# Altium schematic sheet Tiny817_Xplained_Pro_Connectors.SchDoc: Extension connectors
size A3; Organization: ATMEL Norway; Address1: Vestre Rosten 79; Address2: N-7075 TILLER; Address3: NORWAY; DocumentNumber: A09-2654; Revision: 4; SheetNumber: 3; SheetTotal: 9; PageSetup: Record=PageOptions|CenterHorizontal=True|CenterVertical=True|PrintScale=1.01|XCorrection=1.00|YCorrection=1.00|PrintKind=1|BorderSize=5000000|LeftOffset=0|BottomOffset=0|Orientation=2|PaperLength=1000|PaperWidth=1000|Scale=100|PaperSource=7|PrintQuality=-4|MediaType=1|DitherType=10|PaperKind=A3 (297 x 420 mm)|PrintScaleMode=1
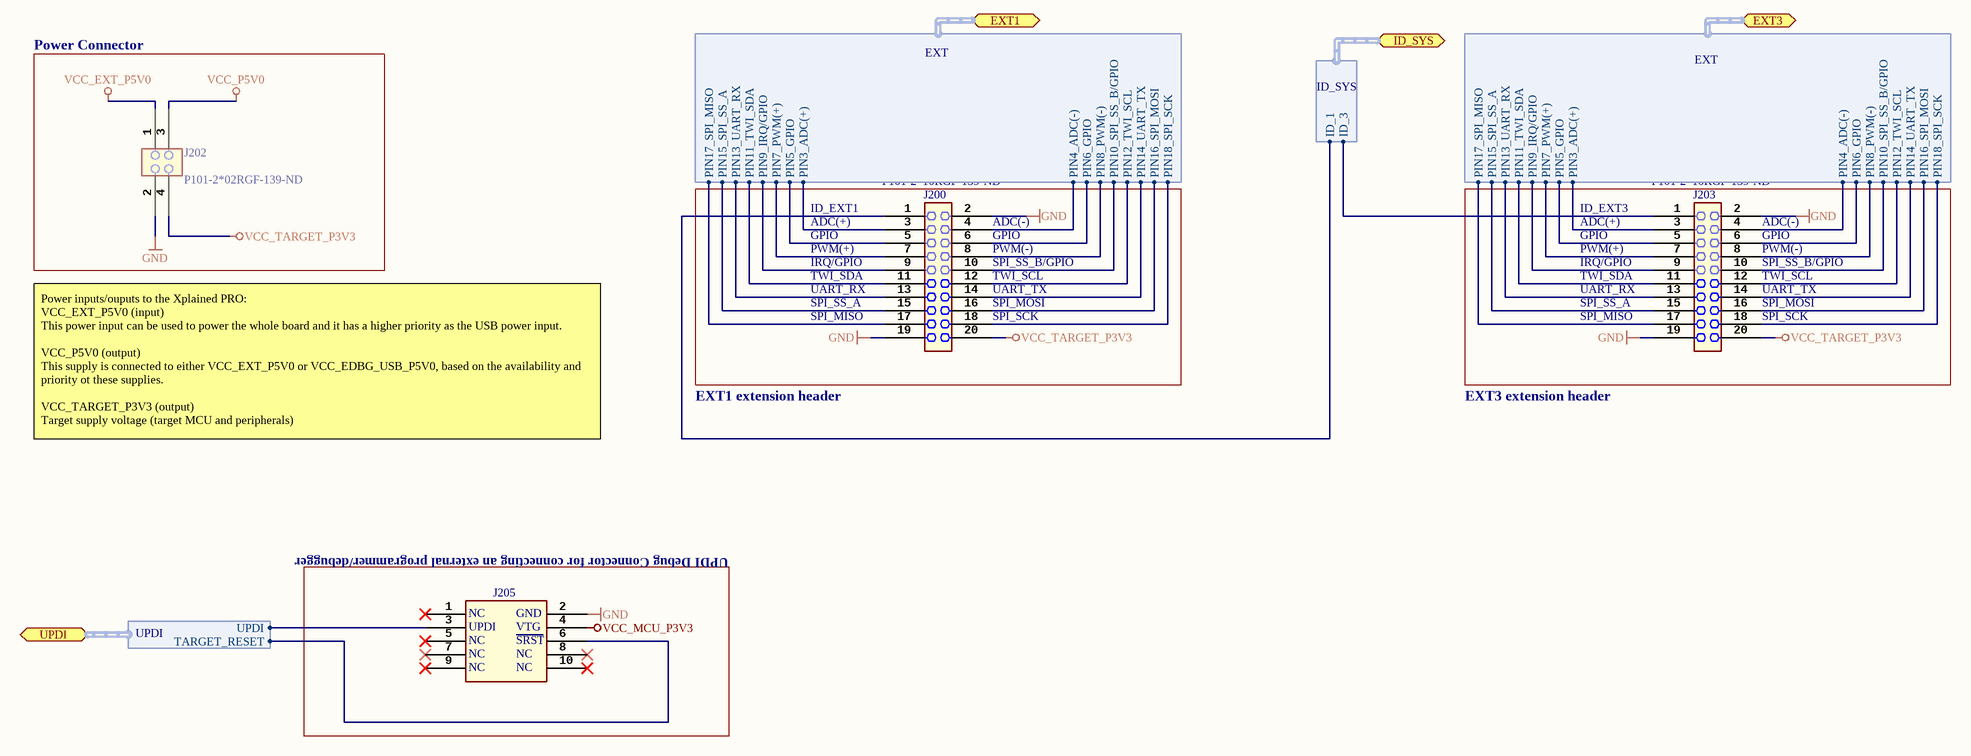
[diagram p0: Tiny817_Xplained_Pro_Connectors.SchDoc]

## Parts
J200  value P101-2*10RGF-139-ND  [AP8-00622]
J202  value P101-2*02RGF-139-ND  [AP8-00628]
J203  value P101-2*10RGF-139-ND  [AP8-00622]
J205  (no value)  [AP8-00257]

## Blocks framed on the sheet
Power Connector: J202

## Ports
EXT1 (harness EXT), EXT3 (harness EXT), ID_SYS (harness ID_SYS), UPDI (harness UPDI)

## Harnesses
ID_SYS: ID_1, ID_3
EXT: PIN3_ADC(+), PIN4_ADC(-), PIN5_GPIO, PIN6_GPIO, PIN7_PWM(+), PIN8_PWM(-), PIN9_IRQ/GPIO, PIN10_SPI_SS_B/GPIO, PIN11_TWI_SDA, PIN12_TWI_SCL, PIN13_UART_RX, PIN14_UART_TX, PIN15_SPI_SS_A, PIN16_SPI_MOSI, PIN17_SPI_MISO, PIN18_SPI_SCK
UPDI: TARGET_RESET, UPDI

## Nets
GND: J200.2 J200.19 J202.2 J203.2 J203.19 J205.2
VCC_EXT_P5V0: J202.1
VCC_MCU_P3V3: J205.4
VCC_P5V0: J202.3
VCC_TARGET_P3V3: J200.20 J202.4 J203.20
NetJ200_1: J200.1 ; port ID_SYS.ID_1
NetJ200_3: J200.3 ; port EXT1.PIN3_ADC(+)
NetJ200_4: J200.4 ; port EXT1.PIN4_ADC(-)
NetJ200_5: J200.5 ; port EXT1.PIN5_GPIO
NetJ200_6: J200.6 ; port EXT1.PIN6_GPIO
NetJ200_7: J200.7 ; port EXT1.PIN7_PWM(+)
NetJ200_8: J200.8 ; port EXT1.PIN8_PWM(-)
NetJ200_9: J200.9 ; port EXT1.PIN9_IRQ/GPIO
NetJ200_10: J200.10 ; port EXT1.PIN10_SPI_SS_B/GPIO
NetJ200_11: J200.11 ; port EXT1.PIN11_TWI_SDA
NetJ200_12: J200.12 ; port EXT1.PIN12_TWI_SCL
NetJ200_13: J200.13 ; port EXT1.PIN13_UART_RX
NetJ200_14: J200.14 ; port EXT1.PIN14_UART_TX
NetJ200_15: J200.15 ; port EXT1.PIN15_SPI_SS_A
NetJ200_16: J200.16 ; port EXT1.PIN16_SPI_MOSI
NetJ200_17: J200.17 ; port EXT1.PIN17_SPI_MISO
NetJ200_18: J200.18 ; port EXT1.PIN18_SPI_SCK
NetJ203_1: J203.1 ; port ID_SYS.ID_3
NetJ203_3: J203.3 ; port EXT3.PIN3_ADC(+)
NetJ203_4: J203.4 ; port EXT3.PIN4_ADC(-)
NetJ203_5: J203.5 ; port EXT3.PIN5_GPIO
NetJ203_6: J203.6 ; port EXT3.PIN6_GPIO
NetJ203_7: J203.7 ; port EXT3.PIN7_PWM(+)
NetJ203_8: J203.8 ; port EXT3.PIN8_PWM(-)
NetJ203_9: J203.9 ; port EXT3.PIN9_IRQ/GPIO
NetJ203_10: J203.10 ; port EXT3.PIN10_SPI_SS_B/GPIO
NetJ203_11: J203.11 ; port EXT3.PIN11_TWI_SDA
NetJ203_12: J203.12 ; port EXT3.PIN12_TWI_SCL
NetJ203_13: J203.13 ; port EXT3.PIN13_UART_RX
NetJ203_14: J203.14 ; port EXT3.PIN14_UART_TX
NetJ203_15: J203.15 ; port EXT3.PIN15_SPI_SS_A
NetJ203_16: J203.16 ; port EXT3.PIN16_SPI_MOSI
NetJ203_17: J203.17 ; port EXT3.PIN17_SPI_MISO
NetJ203_18: J203.18 ; port EXT3.PIN18_SPI_SCK
NetJ205_3: J205.3 ; port UPDI.UPDI
NetJ205_6: J205.6 ; port UPDI.TARGET_RESET

Not connected (* = marked no-connect by the designer): J205 1* 5* 7* 8* 9* 10*

## Notes on the sheet
- ID_EXT1
- ID_EXT3
- ADC(+)
- GPIO
- PWM(+)
- IRQ/GPIO
- TWI_SDA
- UART_RX
- (near J200) ADC(-)
- (near J200) GPIO
- (near J200) PWM(-)
- (near J200) SPI_SS_B/GPIO
- (near J200) TWI_SCL
- (near J200) UART_TX
- (near J203) ADC(-)
- (near J203) GPIO
- (near J203) PWM(-)
- (near J203) SPI_SS_B/GPIO
- (near J203) TWI_SCL
- (near J203) UART_TX
- SPI_SS_A
- SPI_MISO
- (near J200) SPI_MOSI
- (near J200) SPI_SCK
- (near J203) SPI_MOSI
- (near J203) SPI_SCK
- EXT1 extension header
- EXT3 extension header
- Power inputs/ouputs to the Xplained PRO:
  VCC_EXT_P5V0 (input)
  This power input can be used to power the whole board and it has a higher priority as the USB power input.
  VCC_P5V0 (output)
  This supply is connected to either VCC_EXT_P5V0 or VCC_EDBG_USB_P5V0, based on the availability and priority ot these supplies.
  VCC_TARGET_P3V3 (output)
  Target supply voltage (target MCU and peripherals)
- (near J205) UPDI Debug Connector for connecting an external programmer/debugger
- Date:
- PAGE:
- of
- TITLE:
- Document number:
- Revision:
- (in symbol A08-0385) NC; GND; UPDI; VTG; SRST

## Library data of the parts
J200 J203 = A08-1513: Pin header, 2x10, Right Angle, 2.54mm, THM, Pin In Paste; PartGroup: Mechanical devices,Connectors,Pin headers; Manufacturer: Pro-data International Corp; AN: A08-1513; MPN: P101-2*10RGF-139-ND
J202 = A08-1519: Pin header, 2x2, Right Angle, 2.54mm, THT, Pin In Paste; PartGroup: Mechanical devices,Connectors,Pin headers; Manufacturer: Pro-data International Corp; AN: A08-1519; Height: 5,07999992370605; MPN: P101-2*02RGF-139-ND
J205 = A08-0385: 2x5 pin header, 1.27mm pitch, THM; PartGroup: Mechanical devices,Connectors,Pin headers; Manufacturer: Garry; MPN: 176-2-010-0-T-XS0-0730; Value: PIN HEADER 2x5; AN: A08-0385; Height: 7,30000019073486